# Altium project Yolo-Extend.PrjPcb
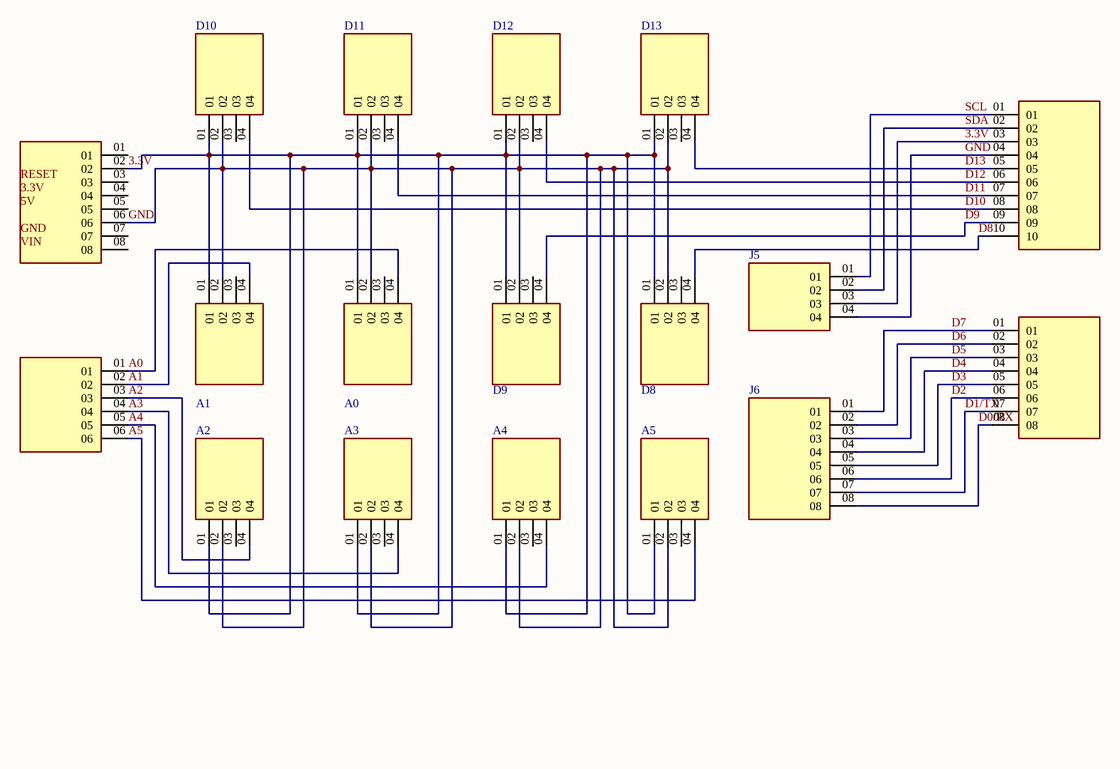
[diagram p0: Schematic.SchDoc]
1 sheet, 18 parts. Net scope: global (net labels, ports and power ports of the same name join across sheets).
Board file: PCB.PcbDoc

## Sheet Schematic.SchDoc: Yolo-Uno extend port board
size A4; SheetNumber: 1; SheetTotal: 1

### Parts
A0  TSW-104-08-L-S-LL  [SAMTEC_TSW-104-08-L-S-LL]  (value not drawn)
A1  TSW-104-08-L-S-LL  [SAMTEC_TSW-104-08-L-S-LL]  (value not drawn)
A2  TSW-104-08-L-S-LL  [SAMTEC_TSW-104-08-L-S-LL]  (value not drawn)
A3  TSW-104-08-L-S-LL  [SAMTEC_TSW-104-08-L-S-LL]  (value not drawn)
A4  TSW-104-08-L-S-LL  [SAMTEC_TSW-104-08-L-S-LL]  (value not drawn)
A5  TSW-104-08-L-S-LL  [SAMTEC_TSW-104-08-L-S-LL]  (value not drawn)
D8  TSW-104-08-L-S-LL  [SAMTEC_TSW-104-08-L-S-LL]  (value not drawn)
D9  TSW-104-08-L-S-LL  [SAMTEC_TSW-104-08-L-S-LL]  (value not drawn)
D10  TSW-104-08-L-S-LL  [SAMTEC_TSW-104-08-L-S-LL]  (value not drawn)
D11  TSW-104-08-L-S-LL  [SAMTEC_TSW-104-08-L-S-LL]  (value not drawn)
D12  TSW-104-08-L-S-LL  [SAMTEC_TSW-104-08-L-S-LL]  (value not drawn)
D13  TSW-104-08-L-S-LL  [SAMTEC_TSW-104-08-L-S-LL]  (value not drawn)
Header6  MTSW-106-08-T-S-300-LL  [SAMTEC_MTSW-106-08-T-S-300-LL]  (value not drawn)
Header8-Left  TSW-108-06-G-S-LL  [SAMTEC_TSW-108-06-G-S-LL]  (value not drawn)
Header8-Right  TSW-108-06-G-S-LL  [SAMTEC_TSW-108-06-G-S-LL]  (value not drawn)
Header10  MTSW-110-10-G-S-595  [SAMTEC_MTSW-110-10-G-S-595]  (value not drawn)
J5  TSW-104-08-L-S-LL  [SAMTEC_TSW-104-08-L-S-LL]  (value not drawn)
J6  TSW-108-06-G-S-LL  [SAMTEC_TSW-108-06-G-S-LL]  (value not drawn)

### Nets
3.3V: A0.01 A1.01 A2.01 A3.01 A4.01 A5.01 D8.01 D9.01 D10.01 D11.01 D12.01 D13.01 Header8-Left.02 Header10.03 J5.03
A0: A0.04 Header6.01
A1: A1.04 Header6.02
A2: A2.04 Header6.03
A3: A3.04 Header6.04
A4: A4.04 Header6.05
A5: A5.04 Header6.06
D0/RX: Header8-Right.08 J6.08
D1/TX: Header8-Right.07 J6.07
D2: Header8-Right.06 J6.06
D3: Header8-Right.05 J6.05
D4: Header8-Right.04 J6.04
D5: Header8-Right.03 J6.03
D6: Header8-Right.02 J6.02
D7: Header8-Right.01 J6.01
D8: D8.04 Header10.10
D9: D9.04 Header10.09
D10: D10.04 Header10.08
D11: D11.04 Header10.07
D12: D12.04 Header10.06
D13: D13.04 Header10.05
GND: A0.02 A1.02 A2.02 A3.02 A4.02 A5.02 D8.02 D9.02 D10.02 D11.02 D12.02 D13.02 Header8-Left.06 Header10.04 J5.04
SCL: Header10.01 J5.01
SDA: Header10.02 J5.02

Not connected (* = marked no-connect by the designer): A0 03; A1 03; A2 03; A3 03; A4 03; A5 03; D8 03; D9 03; D10 03; D11 03; D12 03; D13 03; Header8-Left 01 03 04 05 07 08

### Notes on the sheet
- Labels drawn without touching a wire or pin: 3.3V, 5V, GND, RESET, VIN

### Library data of the parts
A0-A5 D8-D13 J5 = TSW-104-08-L-S-LL: Package: None; Price: None; Value: *; MP: TSW-104-08-L-S-LL; Availability: Unavailable
Header6 = MTSW-106-08-T-S-300-LL: Value: *; Package: None; Availability: Unavailable; MP: MTSW-106-08-T-S-300-LL; Price: None
Header8-Left Header8-Right J6 = TSW-108-06-G-S-LL: Package: None; Price: None; Value: *; MP: TSW-108-06-G-S-LL; Availability: Unavailable
Header10 = MTSW-110-10-G-S-595: Price: None; Availability: Unavailable; Value: *; Package: None; MP: MTSW-110-10-G-S-595